# EAGLE schematic MegaFly_rev4.2 (EAGLE 7.5.0)
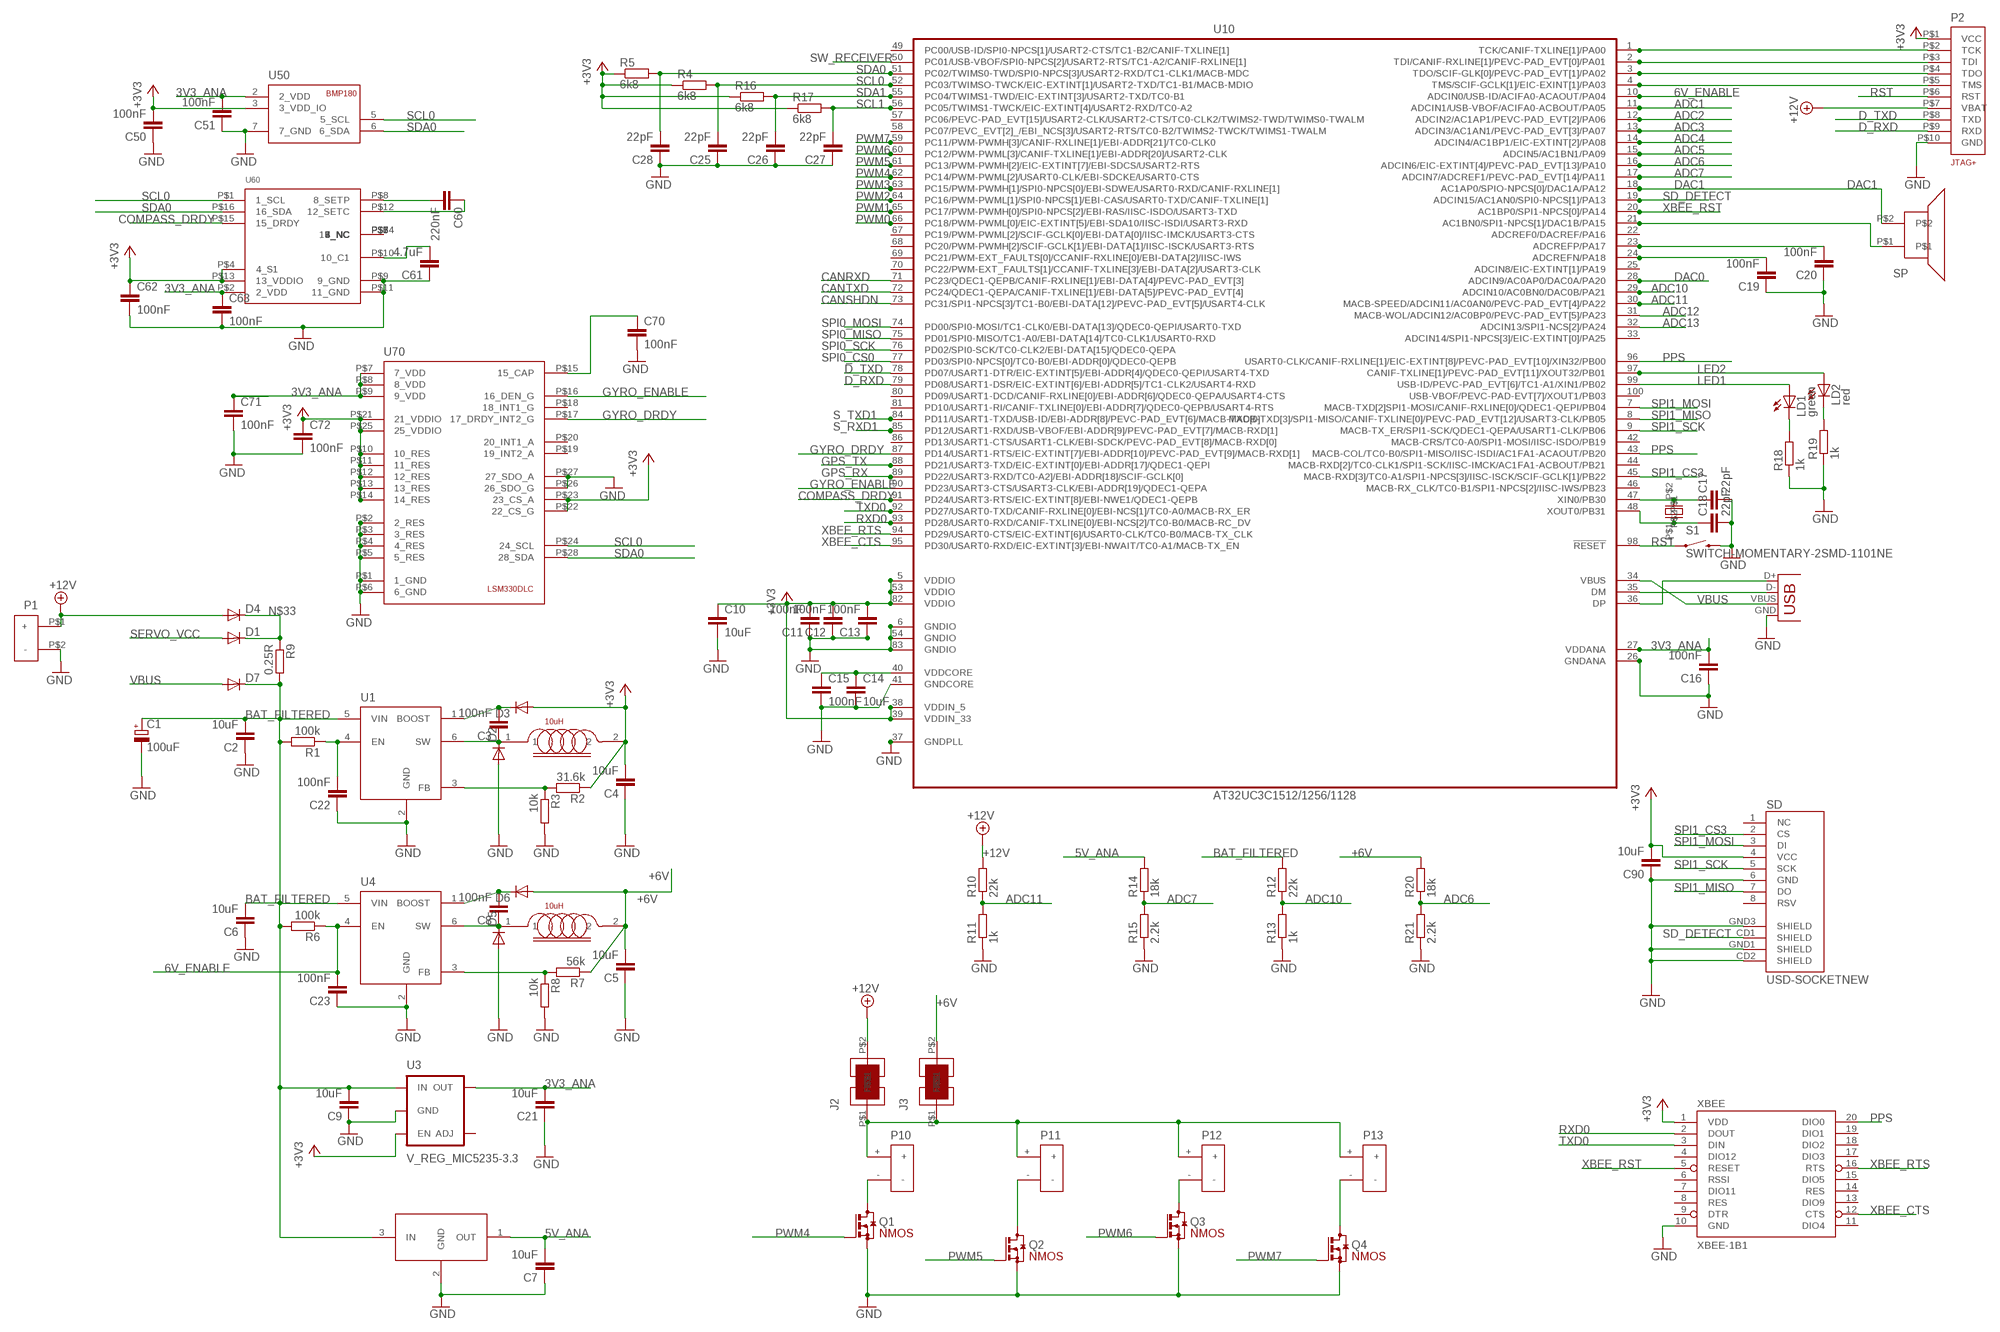
[diagram p0: schematic, sheet 1, part 1 of 2]
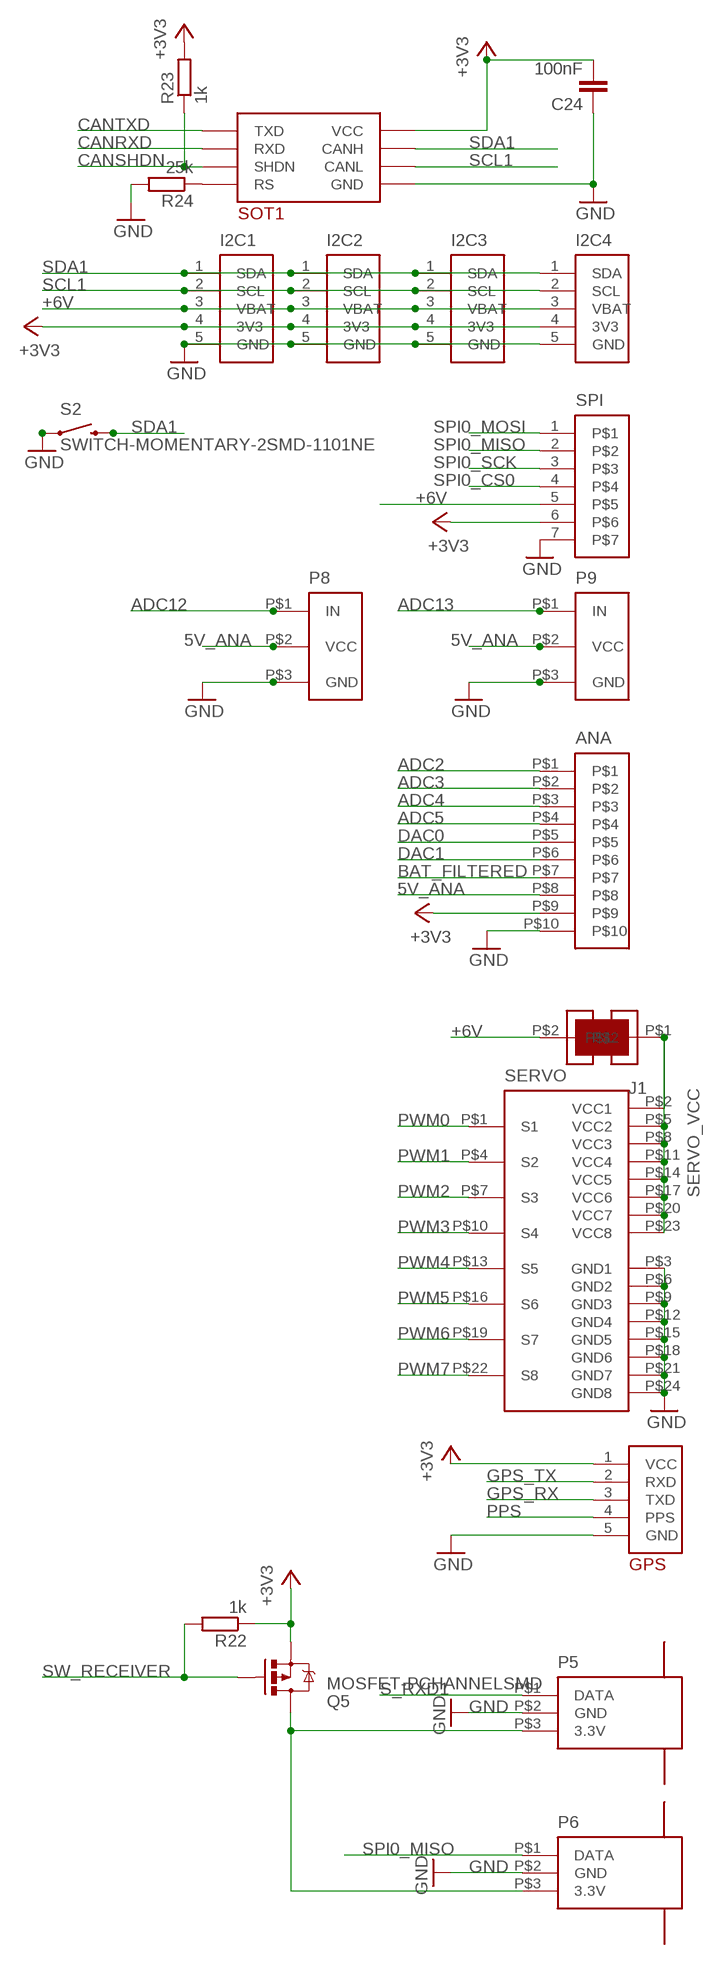
[diagram p1: schematic, sheet 1, part 2 of 2]

## Parts
ANA  MOLEX_CONNECTOR_10PINSMOLEX_PICOBLADE  [MOLEX_CONNECTOR_10PINS]
C1  100uF  CPOL-EUD/7343-31R  [D/7343-31R]
C2  10uF  C-EUC0805  [C0805]
C3  100nF  C-EUC0603  [C0603]
C4  10uF  C-EUC0805  [C0805]
C5  10uF  C-EUC0805  [C0805]
C6  10uF  C-EUC0805  [C0805]
C7  10uF  C-EUC0805  [C0805]
C8  100nF  C-EUC0603  [C0603]
C9  10uF  C-EUC0805  [C0805]
C10  10uF  C-EUC0805  [C0805]
C11  100nF  C-EUC0603  [C0603]
C12  100nF  C-EUC0603  [C0603]
C13  100nF  C-EUC0603  [C0603]
C14  10uF  C-EUC0805  [C0805]
C15  100nF  C-EUC0603  [C0603]
C16  100nF  C-EUC0603  [C0603]
C17  22pF  C-EUC0402  [C0402]
C18  22pF  C-EUC0402  [C0402]
C19  100nF  C-EUC0603  [C0603]
C20  100nF  C-EUC0603  [C0603]
C21  10uF  C-EUC0805  [C0805]
C22  100nF  C-EUC0603  [C0603]
C23  100nF  C-EUC0603  [C0603]
C24  100nF  C-EUC0603  [C0603]
C25  22pF  C-EUC0402  [C0402]
C26  22pF  C-EUC0402  [C0402]
C27  22pF  C-EUC0402  [C0402]
C28  22pF  C-EUC0402  [C0402]
C50  100nF  C-EUC0603  [C0603]
C51  100nF  C-EUC0603  [C0603]
C60  220nF  C-EUC0805  [C0805]
C61  4.7uF  C-EUC0805  [C0805]
C62  100nF  C-EUC0603  [C0603]
C63  100nF  C-EUC0603  [C0603]
C70  100nF  C-EUC0603  [C0603]
C71  100nF  C-EUC0603  [C0603]
C72  100nF  C-EUC0603  [C0603]
C90  10uF  C-EUC0805  [C0805]
D1  DIODESOD  [SOD-323]
D2  DIODESOD  [SOD-323]
D3  DIODESOD  [SOD-323]
D4  DIODESOD  [SOD-323]
D5  DIODESOD  [SOD-323]
D6  DIODESOD  [SOD-323]
D7  DIODESOD  [SOD-323]
GPS  APM2.5_GPS_HEADERVERTICAL  [MOLEX_CONNECTOR_5_PINS_VERTICAL]
I2C1  I2C_BUS_PICOVERTICAL  [MOLEX_CONNECTOR_5_PINS_VERTICAL]
I2C2  I2C_BUS_PICOVERTICAL  [MOLEX_CONNECTOR_5_PINS_VERTICAL]
I2C3  I2C_BUS_PICOVERTICAL  [MOLEX_CONNECTOR_5_PINS_VERTICAL]
I2C4  I2C_BUS_PICOVERTICAL  [MOLEX_CONNECTOR_5_PINS_VERTICAL]
J1  SOLDER_JUMPER_2WAY  [SOLDER_JUMPER_2WAY]
J2  SOLDER_JUMPER_2WAY  [SOLDER_JUMPER_2WAY]
J3  SOLDER_JUMPER_2WAY  [SOLDER_JUMPER_2WAY]
L1  10uH  INDUCTOR1210  [C1210]
L2  10uH  INDUCTOR1210  [C1210]
LD1  green  LEDCHIPLED_0805_GREEN  [CHIPLED_0805]
LD2  red  LEDCHIPLED_0805_RED  [CHIPLED_0805]
P1  POWER  [POWER]
P2  AVR32_JTAG+SERIALMOLEX_PICOBLADE  [MOLEX_CONNECTOR_10PINS]
P5  SPEKTRUM_RECEIVER  [JST_1.5MM_3WAY]
P6  SPEKTRUM_RECEIVER  [JST_1.5MM_3WAY]
P8  SENSOR  [SERVO_COMPACT]
P9  SENSOR  [SERVO_COMPACT]
P10  POWERSMALL_SMD  [POWER_SMALL_SMD]
P11  POWERSMALL_SMD  [POWER_SMALL_SMD]
P12  POWERSMALL_SMD  [POWER_SMALL_SMD]
P13  POWERSMALL_SMD  [POWER_SMALL_SMD]
Q1  N-CHANNEL_SOT23  [SOT23]
Q2  N-CHANNEL_SOT23  [SOT23]
Q3  N-CHANNEL_SOT23  [SOT23]
Q4  N-CHANNEL_SOT23  [SOT23]
Q5  MOSFET-PCHANNELSMD  [SOT23-3]
R1  100k  R-EU_R0603  [R0603]
R2  31.6k  R-EU_R0603  [R0603]
R3  10k  R-EU_R0603  [R0603]
R4  6k8  R-EU_R0603  [R0603]
R5  6k8  R-EU_R0603  [R0603]
R6  100k  R-EU_R0603  [R0603]
R7  56k  R-EU_R0603  [R0603]
R8  10k  R-EU_R0603  [R0603]
R9  0.25R  R-EU_R0805  [R0805]
R10  22k  R-EU_R0603  [R0603]
R11  1k  R-EU_R0603  [R0603]
R12  22k  R-EU_R0603  [R0603]
R13  1k  R-EU_R0603  [R0603]
R14  18k  R-EU_R0603  [R0603]
R15  2.2k  R-EU_R0603  [R0603]
R16  6k8  R-EU_R0603  [R0603]
R17  6k8  R-EU_R0603  [R0603]
R18  1k  R-EU_R0603  [R0603]
R19  1k  R-EU_R0603  [R0603]
R20  18k  R-EU_R0603  [R0603]
R21  2.2k  R-EU_R0603  [R0603]
R22  1k  R-EU_R0603  [R0603]
R23  1k  R-EU_R0603  [R0603]
R24  25k  R-EU_R0603  [R0603]
S1  SWITCH-MOMENTARY-2SMD-1101NE  [TACTILE-SWITCH-1101NE]
S2  SWITCH-MOMENTARY-2SMD-1101NE  [TACTILE-SWITCH-1101NE]
SD  USD-SOCKETNEW  [MICRO-SD-SOCKET-PP]
SERVO  SERVOCONNECTOR_X8STANDARD  [HEADER3X8]
SOT1  MAX3051  [SOT23-8L]
SP  PIEZO_SPEAKERSMALLER  [PIEZO_CMT_1203-SMT-REDUCED_FOOTPRINT]
SPI  MOLEX_CONNECTOR_7PINS  [MOLEX_CONNECTOR_7PINS]
U1  LM2734  [SOT23-6]
U2  MC78L05  LDO_3PINSOT89_MC78LXX  [SOT89]
U3  V_REG_MIC5235-3.3  V_REG_MIC5235  [SOT23-5]
U4  LM2734  [SOT23-6]
U10  AT32UC3C1512/1256/1128  [TQFP100]
U50  BMP180  [BMP180]
U60  HMC5883L  [LPCC16_0.5MM]
U70  LSM330DLC  [LSM330DLC]
USB  USB-MICROB  [USB-MICROB]
X1  CRYSTAL:ABM_16MHz  CRYSTAL  [SMD_CRYSTAL_ABM]
XBEE  XBEE-1B1  [XBEE-1]

## Nets
3V3_ANA: C16.2 C21.2 C51.2 C63.1 C71.1 U3.5(OUT) U10.27(VDDANA) U50.2(2_VDD) U60.P$2(2_VDD) U70.P$7(7_VDD) U70.P$8(8_VDD) U70.P$9(9_VDD)
5V_ANA [power]: ANA.P$8 C7.2 P8.P$2(VCC) P9.P$2(VCC) R14.2 U2.1(OUT)
6V_ENABLE: C23.2 R6.1 U4.4(EN) U10.10(ADCIN0/USB-ID/ACIFA0-ACAOUT/PA04)
+3V3 [power]: ANA.P$9 C4.2 C10.1 C11.2 C12.2 C13.2 C24.2 C50.2 C62.1 C72.1 C90.2 D3.2(A) GPS.1(VCC) I2C1.4(3V3) I2C2.4(3V3) I2C3.4(3V3) I2C4.4(3V3) L1.2 P2.P$1(VCC) Q5.2(S) R2.1 R4.1 R5.1 R16.1 R17.1 R22.1 R23.2 SD.4(VCC) SOT1.P$3(VCC) SPI.6 U3.3(EN) U10.5(VDDIO) U10.38(VDDIN_5) U10.39(VDDIN_33) U10.53(VDDIO) U10.82(VDDIO) U50.3(3_VDD_IO) U60.P$4(4_S1) U60.P$13(13_VDDIO) U70.P$10(10_RES) U70.P$11(11_RES) U70.P$12(12_RES) U70.P$13(13_RES) U70.P$14(14_RES) U70.P$21(21_VDDIO) U70.P$22(22_CS_G) U70.P$23(23_CS_A) U70.P$25(25_VDDIO) XBEE.1(VDD)
+6V [power]: C5.2 D6.2(A) I2C1.3(VBAT) I2C2.3(VBAT) I2C3.3(VBAT) I2C4.3(VBAT) J1.P$2 J3.P$2 L2.2 R7.1 R20.2 SPI.5
+12V [more_power]: D4.2(A) J2.P$2 P1.P$1(+) P2.P$7(VBAT) R10.2
ADC1: U10.11(ADCIN1/USB-VBOF/ACIFA0-ACBOUT/PA05)
ADC2: ANA.P$1 U10.12(ADCIN2/AC1AP1/PEVC-PAD_EVT[2]/PA06)
ADC3: ANA.P$2 U10.13(ADCIN3/AC1AN1/PEVC-PAD_EVT[3]/PA07)
ADC4: ANA.P$3 U10.14(ADCIN4/AC1BP1/EIC-EXTINT[2]/PA08)
ADC5: ANA.P$4 U10.15(ADCIN5/AC1BN1/PA09)
ADC6: R20.1 R21.2 U10.16(ADCIN6/EIC-EXTINT[4]/PEVC-PAD_EVT[13]/PA10)
ADC7: R14.1 R15.2 U10.17(ADCIN7/ADCREF1/PEVC-PAD_EVT[14]/PA11)
ADC10: R12.1 R13.2 U10.29(ADCIN10/AC0BN0/DAC0B/PA21)
ADC11: R10.1 R11.2 U10.30(MACB-SPEED/ADCIN11/AC0AN0/PEVC-PAD_EVT[4]/PA22)
ADC12: P8.P$1(IN) U10.31(MACB-WOL/ADCIN12/AC0BP0/PEVC-PAD_EVT[5]/PA23)
ADC13: P9.P$1(IN) U10.32(ADCIN13/SPI1-NCS[2]/PA24)
BAT_FILTERED [more_power]: ANA.P$7 C1.+ C2.2 C6.2 C9.2 D7.1(C) R1.2 R6.2 R9.2 R12.2 U1.5(VIN) U2.3(IN) U3.1(IN) U4.5(VIN)
CANRXD: SOT1.P$4(RXD) U10.71(PC23/QDEC1-QEPB/CANIF-RXLINE[1]/EBI-DATA[4]/PEVC-PAD_EVT[3])
CANSHDN: R23.1 SOT1.P$5(SHDN) U10.73(PC31/SPI1-NPCS[3]/TC1-B0/EBI-DATA[12]/PEVC-PAD_EVT[5]/USART4-CLK)
CANTXD: SOT1.P$1(TXD) U10.72(PC24/QDEC1-QEPA/CANIF-TXLINE[1]/EBI-DATA[5]/PEVC-PAD_EVT[4])
COMPASS_DRDY: U10.91(PD24/USART3-RTS/EIC-EXTINT[8]/EBI-NWE1/QDEC1-QEPB) U60.P$15(15_DRDY)
D_RXD: P2.P$9(RXD) U10.79(PD08/USART1-DSR/EIC-EXTINT[6]/EBI-ADDR[5]/TC1-CLK2/USART4-RXD)
D_TXD: P2.P$8(TXD) U10.78(PD07/USART1-DTR/EIC-EXTINT[5]/EBI-ADDR[4]/QDEC0-QEPI/USART4-TXD)
DAC0: ANA.P$5 U10.28(ADCIN9/AC0AP0/DAC0A/PA20)
DAC1: ANA.P$6 SP.P$2 U10.18(AC1AP0/SPIO-NPCS[0]/DAC1A/PA12)
GND [power]: ANA.P$10 C1.- C2.1 C4.1 C5.1 C6.1 C7.1 C9.1 C10.2 C11.1 C12.1 C13.1 C14.2 C15.2 C16.1 C17.2 C18.2 C19.1 C20.1 C21.1 C22.1 C23.1 C24.1 C25.1 C26.1 C27.1 C28.1 C50.1 C51.1 C61.1 C62.2 C63.2 C70.2 C71.2 C72.2 C90.1 D2.2(A) D5.2(A) GPS.5(GND) I2C1.5(GND) I2C2.5(GND) I2C3.5(GND) I2C4.5(GND) P1.P$2(-) P2.P$10(GND) P5.P$2(GND) P6.P$2(GND) P8.P$3(GND) P9.P$3(GND) Q1.2(S) Q2.2(S) Q3.2(S) Q4.2(S) R3.2 R8.2 R11.1 R13.1 R15.1 R18.1 R19.1 R21.1 R24.2 S1.P$2 S2.P$1 SD.6(GND) SD.CD2(SHIELD) SD.GND1(SHIELD) SD.GND3(SHIELD) SERVO.P$3(GND1) SERVO.P$6(GND2) SERVO.P$9(GND3) SERVO.P$12(GND4) SERVO.P$15(GND5) SERVO.P$18(GND6) SERVO.P$21(GND7) SERVO.P$24(GND8) SOT1.P$2(GND) SPI.7 U1.2(GND) U2.2(GND) U3.2(GND) U4.2(GND) U10.6(GNDIO) U10.26(GNDANA) U10.37(GNDPLL) U10.41(GNDCORE) U10.54(GNDIO) U10.83(GNDIO) U50.7(7_GND) U60.P$9(9_GND) U60.P$11(11_GND) U70.P$1(1_GND) U70.P$2(2_RES) U70.P$3(3_RES) U70.P$4(4_RES) U70.P$5(5_RES) U70.P$6(6_GND) U70.P$26(26_SDO_G) U70.P$27(27_SDO_A) USB.GND XBEE.10(GND)
GPS_RX: GPS.3(TXD) U10.89(PD22/USART3-RXD/TC0-A2]/EBI-ADDR[18]/SCIF-GCLK[0])
GPS_TX: GPS.2(RXD) U10.88(PD21/USART3-TXD/EIC-EXTINT[0]/EBI-ADDR[17]/QDEC1-QEPI)
GYRO_DRDY: U10.87(PD14/USART1-RTS/EIC-EXTINT[7]/EBI-ADDR[10]/PEVC-PAD_EVT[9]/MACB-RXD[1]) U70.P$17(17_DRDY_INT2_G)
GYRO_ENABLE: U10.90(PD23/USART3-CTS/USART3-CLK/EBI-ADDR[19]/QDEC1-QEPA) U70.P$16(16_DEN_G)
LED1: LD1.A U10.99(USB-ID/PEVC-PAD_EVT[6]/TC1-A1/XIN1/PB02)
LED2: LD2.A U10.97(CANIF-TXLINE[1]/PEVC-PAD_EVT[11]/XOUT32/PB01)
N$1: P2.P$5(TMS) U10.4(TMS/SCIF-GCLK[1]/EIC-EXINT[1]/PA03)
N$2: P2.P$4(TDO) U10.3(TDO/SCIF-GLK[0]/PEVC-PAD_EVT[1]/PA02)
N$3: C18.1 U10.48(XOUT0/PB31) X1.P$1
N$4: C17.1 U10.47(XIN0/PB30) X1.P$2
N$5: LD1.C R18.2
N$6: C22.2 R1.1 U1.4(EN)
N$7: LD2.C R19.2
N$8 [more_power]: C3.1 D2.1(C) L1.1 U1.6(SW)
N$9 [power]: R2.2 R3.1 U1.3(FB)
N$10: C3.2 D3.1(C) U1.1(BOOST)
N$11: SP.P$1 U10.21(AC1BN0/SPI1-NPCS[1]/DAC1B/PA15)
N$12: C61.2 U60.P$10(10_C1)
N$13: C60.2 U60.P$8(8_SETP)
N$14: C60.1 U60.P$12(12_SETC)
N$15: C70.1 U70.P$15(15_CAP)
N$16 [more_power]: J2.P$1 J3.P$1 P10.+ P11.+ P12.+ P13.+
N$17: P2.P$3(TDI) U10.2(TDI/CANIF-RXLINE[1]/PEVC-PAD_EVT[0]/PA01)
N$18 [more_power]: C8.1 D5.1(C) L2.1 U4.6(SW)
N$19: C14.1 C15.1 U10.40(VDDCORE)
N$20 [power]: R7.2 R8.1 U4.3(FB)
N$21: C8.2 D6.1(C) U4.1(BOOST)
N$22: P10.- Q1.3(D)
N$24: P11.- Q2.3(D)
N$25: P12.- Q3.3(D)
N$26: P13.- Q4.3(D)
N$28: U10.36(DP) USB.D+
N$29: P2.P$2(TCK) U10.1(TCK/CANIF-TXLINE[1]/PA00)
N$30: U10.35(DM) USB.D-
N$31: C19.2 U10.24(ADCREFN/PA18)
N$32: C20.2 U10.23(ADCREFP/PA17)
N$33 [more_power]: D1.1(C) D4.1(C) R9.1
N$34: P5.P$3(3.3V) P6.P$3(3.3V) Q5.3(D)
N$35: R24.1 SOT1.P$8(RS)
PPS: GPS.4(PPS) U10.43(MACB-COL/TC0-B0/SPI1-MISO/IISC-ISDI/AC1FA1-ACAOUT/PB20) U10.96(USART0-CLK/CANIF-RXLINE[1]/EIC-EXTINT[8]/PEVC-PAD_EVT[10]/XIN32/PB00) XBEE.20(DIO0)
PWM0: SERVO.P$1(S1) U10.66(PC18/PWM-PWML[0]/EIC-EXTINT[5]/EBI-SDA10/IISC-ISDI/USART3-RXD)
PWM1: SERVO.P$4(S2) U10.65(PC17/PWM-PWMH[0]/SPI0-NPCS[2]/EBI-RAS/IISC-ISDO/USART3-TXD)
PWM2: SERVO.P$7(S3) U10.64(PC16/PWM-PWML[1]/SPI0-NPCS[1]/EBI-CAS/USART0-TXD/CANIF-TXLINE[1])
PWM3: SERVO.P$10(S4) U10.63(PC15/PWM-PWMH[1]/SPI0-NPCS[0]/EBI-SDWE/USART0-RXD/CANIF-RXLINE[1])
PWM4: Q1.1(G) SERVO.P$13(S5) U10.62(PC14/PWM-PWML[2]/USART0-CLK/EBI-SDCKE/USART0-CTS)
PWM5: Q2.1(G) SERVO.P$16(S6) U10.61(PC13/PWM-PWMH[2]/EIC-EXTINT[7]/EBI-SDCS/USART2-RTS)
PWM6: Q3.1(G) SERVO.P$19(S7) U10.60(PC12/PWM-PWML[3]/CANIF-TXLINE[1]/EBI-ADDR[20]/USART2-CLK)
PWM7: Q4.1(G) SERVO.P$22(S8) U10.59(PC11/PWM-PWMH[3]/CANIF-RXLINE[1]/EBI-ADDR[21]/TC0-CLK0)
RST: P2.P$6(RST) S1.P$1 U10.98(!RESET)
RXD0: U10.93(PD28/USART0-RXD/CANIF-TXLINE[0]/EBI-NCS[2]/TC0-B0/MACB-RC_DV) XBEE.2(DOUT)
S_RXD1: P5.P$1(DATA) U10.85(PD12/USART1-RXD/USB-VBOF/EBI-ADDR[9]/PEVC-PAD_EVT[7]/MACB-RXD[1])
S_TXD1: U10.84(PD11/USART1-TXD/USB-ID/EBI-ADDR[8]/PEVC-PAD_EVT[6]/MACB-TXD[0])
SCL0: C25.2 R4.2 U10.52(PC03/TWIMSO-TWCK/EIC-EXTINT[1]/USART2-TXD/TC1-B1/MACB-MDIO) U50.5(5_SCL) U60.P$1(1_SCL) U70.P$24(24_SCL)
SCL1: C27.2 I2C1.2(SCL) I2C2.2(SCL) I2C3.2(SCL) I2C4.2(SCL) R17.2 SOT1.P$6(CANL) U10.56(PC05/TWIMS1-TWCK/EIC-EXTINT[4]/USART2-RXD/TC0-A2)
SD_DETECT: SD.CD1(SHIELD) U10.19(ADCIN15/AC1AN0/SPI0-NPCS[1]/PA13)
SDA0: C28.2 R5.2 U10.51(PC02/TWIMS0-TWD/SPI0-NPCS[3]/USART2-RXD/TC1-CLK1/MACB-MDC) U50.6(6_SDA) U60.P$16(16_SDA) U70.P$28(28_SDA)
SDA1: C26.2 I2C1.1(SDA) I2C2.1(SDA) I2C3.1(SDA) I2C4.1(SDA) R16.2 S2.P$2 SOT1.P$7(CANH) U10.55(PC04/TWIMS1-TWD/EIC-EXTINT[3]/USART2-TXD/TC0-B1)
SERVO_VCC [more_power]: D1.2(A) J1.P$1 SERVO.P$2(VCC1) SERVO.P$5(VCC2) SERVO.P$8(VCC3) SERVO.P$11(VCC4) SERVO.P$14(VCC5) SERVO.P$17(VCC6) SERVO.P$20(VCC7) SERVO.P$23(VCC8)
SPI0_CS0: SPI.4 U10.77(PD03/SPI0-NPCS[0]/TC0-B0/EBI-ADDR[0]/QDEC0-QEPB)
SPI0_MISO: P6.P$1(DATA) SPI.2 U10.75(PD01/SPI0-MISO/TC1-A0/EBI-DATA[14]/TC0-CLK1/USART0-RXD)
SPI0_MOSI: SPI.1 U10.74(PD00/SPI0-MOSI/TC1-CLK0/EBI-DATA[13]/QDEC0-QEPI/USART0-TXD)
SPI0_SCK: SPI.3 U10.76(PD02/SPI0-SCK/TC0-CLK2/EBI-DATA[15]/QDEC0-QEPA)
SPI1_CS3: SD.2(CS) U10.45(MACB-RXD[3]/TC0-A1/SPI1-NPCS[3]/IISC-ISCK/SCIF-GCLK[1]/PB22)
SPI1_MISO: SD.7(DO) U10.8(MACB-TXD[3]/SPI1-MISO/CANIF-TXLINE[0]/PEVC-PAD_EVT[12]/USART3-CLK/PB05)
SPI1_MOSI: SD.3(DI) U10.7(MACB-TXD[2]SPI1-MOSI/CANIF-RXLINE[0]/QDEC1-QEPI/PB04)
SPI1_SCK: SD.5(SCK) U10.9(MACB-TX_ER/SPI1-SCK/QDEC1-QEPA/USART1-CLK/PB06)
SW_RECEIVER: Q5.1(G) R22.2 U10.50(PC01/USB-VBOF/SPI0-NPCS[2]/USART2-RTS/TC1-A2/CANIF-RXLINE[1])
TXD0: U10.92(PD27/USART0-TXD/CANIF-RXLINE[0]/EBI-NCS[1]/TC0-A0/MACB-RX_ER) XBEE.3(DIN)
VBUS: D7.2(A) U10.34(VBUS) USB.VBUS
XBEE_CTS: U10.95(PD30/USART0-RXD/EIC-EXTINT[3]/EBI-NWAIT/TC0-A1/MACB-TX_EN) XBEE.12(CTS)
XBEE_RST: U10.20(AC1BP0/SPI1-NPCS[0]/PA14) XBEE.5(RESET)
XBEE_RTS: U10.94(PD29/USART0-CTS/EIC-EXTINT[6]/USART0-CLK/TC0-B0/MACB-TX_CLK) XBEE.16(RTS)
Unconnected: SD.1(NC) SD.8(RSV) U3.4(ADJ) U10.22(ADCREF0/DACREF/PA16) U10.25(ADCIN8/EIC-EXTINT[1]/PA19) U10.33(ADCIN14/SPI1-NPCS[3]/EIC-EXTINT[0]/PA25) U10.42(MACB-CRS/TC0-A0/SPI1-MOSI/IISC-ISDO/PB19) U10.44(MACB-RXD[2]/TC0-CLK1/SPI1-SCK/IISC-IMCK/AC1FA1-ACBOUT/PB21) U10.46(MACB-RX_CLK/TC0-B1/SPI1-NPCS[2]/IISC-IWS/PB23) U10.49(PC00/USB-ID/SPI0-NPCS[1]/USART2-CTS/TC1-B2/CANIF-TXLINE[1]) U10.57(PC06/PEVC-PAD_EVT[15]/USART2-CLK/USART2-CTS/TC0-CLK2/TWIMS2-TWD/TWIMS0-TWALM) U10.58(PC07/PEVC_EVT[2]_/EBI_NCS[3]/USART2-RTS/TC0-B2/TWIMS2-TWCK/TWIMS1-TWALM) U10.67(PC19/PWM-PWML[2]/SCIF-GCLK[0]/EBI-DATA[0]/IISC-IMCK/USART3-CTS) U10.68(PC20/PWM-PWMH[2]/SCIF-GCLK[1]/EBI-DATA[1]/IISC-ISCK/USART3-RTS) U10.69(PC21/PWM-EXT_FAULTS[0]/CCANIF-RXLINE[0]/EBI-DATA[2]/IISC-IWS) U10.70(PC22/PWM-EXT_FAULTS[1]/CCANIF-TXLINE[3]/EBI-DATA[2]/USART3-CLK) U10.80(PD09/USART1-DCD/CANIF-RXLINE[0]/EBI-ADDR[6]/QDEC0-QEPA/USART4-CTS) U10.81(PD10/USART1-RI/CANIF-TXLINE[0]/EBI-ADDR[7]/QDEC0-QEPB/USART4-RTS) U10.86(PD13/USART1-CTS/USART1-CLK/EBI-SDCK/PEVC-PAD_EVT[8]/MACB-RXD[0]) U10.100(USB-VBOF/PEVC-PAD-EVT[7]/XOUT1/PB03) U60.P$3(3_NC) U60.P$5(5_NC) U60.P$6(6_NC) U60.P$7(7_NC) U60.P$14(14_NC) U70.P$18(18_INT1_G) U70.P$19(19_INT2_A) U70.P$20(20_INT1_A) XBEE.4(DIO12) XBEE.6(RSSI) XBEE.7(DIO11) XBEE.8(RES) XBEE.9(DTR) XBEE.11(DIO4) XBEE.13(DIO9) XBEE.14(RES) XBEE.15(DIO5) XBEE.17(DIO3) XBEE.18(DIO2) XBEE.19(DIO1)

## Library data of the parts
ANA = con-special_purpose:MOLEX_CONNECTOR_10PINS: Molex Connector : PicoBlade 1.25 mm pitch, 10 pins, Vertical SMD; DISTRIBUTOR: Digikey; ORDER_CODE: WM7628CT-ND; PLACE_PART: YES; UNIT_PRICE: 1.74; UNIT_PRICE_100X: 1.3578; UNIT_PRICE_10X: 1.584; UNIT_PRICE_25X: 1.4868; UNIT_PRICE_50X: 1.4224
C1 = rcl:CPOL-EU: POLARIZED CAPACITOR, European symbol; DISTRIBUTOR: Digikey; ORDER_CODE: 718-1744-1-ND; PLACE_PART: YES; UNIT_PRICE: 1.23; UNIT_PRICE_100X: 0.8079; UNIT_PRICE_10X: 1.004; UNIT_PRICE_25X: 1.004; UNIT_PRICE_50X: 1.004
C2-C28 C50 C51 C60-C63 C70-C72 C90 = rcl:C-EU: CAPACITOR, European symbol; PLACE_PART: YES
D1-D7 = power:DIODE: Diode These are standard reverse protection diodes and small signal diodes. SMA package can handle up to about 1A. SOD-323 can handle about 200mA. What the SOD-323 package when ordering, there are some mfgs out there that are 5-pin packages.; DISTRIBUTOR: Digikey; ORDER_CODE: 568-4128-1-ND; PLACE_PART: YES; UNIT_PRICE: 0.36; UNIT_PRICE_100X: 0.1907; UNIT_PRICE_10X: 0.277; UNIT_PRICE_25X: 0.234; UNIT_PRICE_50X: 0.234
GPS = con-special_purpose:APM2.5_GPS_HEADER; DISTRIBUTOR: Digikey; ORDER_CODE: WM7609CT-ND; PLACE_PART: YES; UNIT_PRICE: 1.28; UNIT_PRICE_100X: 0.9771; UNIT_PRICE_10X: 1.132; UNIT_PRICE_25X: 1.0656; UNIT_PRICE_50X: 1.0214
I2C1-I2C4 = con-special_purpose:I2C_BUS_PICO; DISTRIBUTOR: Digikey; ORDER_CODE: WM7609CT-ND; PLACE_PART: YES; UNIT_PRICE: 1.28; UNIT_PRICE_100X: 0.9771; UNIT_PRICE_10X: 1.132; UNIT_PRICE_25X: 1.0656; UNIT_PRICE_50X: 1.0214
J1-J3 = con-special_purpose:SOLDER_JUMPER_2WAY; PLACE_PART: NO
L1 L2 = power:INDUCTOR; DISTRIBUTOR: Digikey; ORDER_CODE: 445-4847-1-ND; PLACE_PART: YES; UNIT_PRICE: 0.36; UNIT_PRICE_100X: 0.2423; UNIT_PRICE_10X: 0.323; UNIT_PRICE_25X: 0.323; UNIT_PRICE_50X: 0.2624
LD1 = LEDs:LED: LED OSRAM: - CHIPLED LG R971, LG N971, LY N971, LG Q971, LY Q971, LO R971, LY R971 LH N974, LH R974 LS Q976, LO Q976, LY Q976 LO Q996 - Hyper CHIPLED LW Q18S LB Q993, LB Q99A, LB R99A - SideLED LS A670, LO A670, LY A670, LG A670, LP A670 LB A673, LV A673, LT A673, LW A673 LH A674 LY A675 LS A676, LA A676, LO A676, LY A676, LW A676 LS A679, LY A679, LG A679 - Hyper Micro SIDELED® LS Y876, LA Y876, LO Y876, LY Y876 LT Y87S - SmartLED LW L88C, LW L88S LB L89C, LB L89S, LG L890 LS L89K, LO L89K, LY L89K LS L896, LA L896, LO L896, LY L896 - TOPLED LS T670, LO T670, LY T670, LG T670, LP T670 LSG T670, LSP T670, LSY T670, LOP T670, LYG T670 LG T671, LOG T671, LSG T671 LB T673, LV T673, LT T673, LW T673 LH T674 LS T676, LA T676, LO T676, LY T676, LB T676, LH T676, LSB T676, LW T676 LB T67C, LV T67C, LT T67C, LS T67K, LO T67K, LY T67K, LW E67C LS E67B, LA E67B, LO E67B, LY E67B, LB E67C, LV E67C, LT E67C LW T67C LS T679, LY T679, LG T679 LS T770, LO T770, LY T770, LG T770, LP T770 LB T773, LV T773, LT T773, LW T773 LH T774 LS E675, LA E675, LY E675, LS T675 LS T776, LA T776, LO T776, LY T776, LB T776 LHGB T686 LT T68C, LB T68C - Hyper Mini TOPLED® LB M676 - Mini TOPLED Santana® LG M470 LS M47K, LO M47K, LY M47K Source: http://www.osram.convergy.de LUXEON: - LUMILED® LXK2-PW12-R00, LXK2-PW12-S00, LXK2-PW14-U00, LXK2-PW14-V00 LXK2-PM12-R00, LXK2-PM12-S00, LXK2-PM14-U00 LXK2-PE12-Q00, LXK2-PE12-R00, LXK2-PE12-S00, LXK2-PE14-T00, LXK2-PE14-U00 LXK2-PB12-K00, LXK2-PB12-L00, LXK2-PB12-M00, LXK2-PB14-N00, LXK2-PB14-P00, LXK2-PB14-Q00 LXK2-PR12-L00, LXK2-PR12-M00, LXK2-PR14-Q00, LXK2-PR14-R00 LXK2-PD12-Q00, LXK2-PD12-R00, LXK2-PD12-S00 LXK2-PH12-R00, LXK2-PH12-S00 LXK2-PL12-P00, LXK2-PL12-Q00, LXK2-PL12-R00 Source: www.luxeon.com KINGBRIGHT: KA-3528ASYC Source: www.kingbright.com; DISTRIBUTOR: Digikey; ORDER_CODE: 754-1131-1-ND; PLACE_PART: YES; UNIT_PRICE: 0.25; UNIT_PRICE_100X: 0.1365; UNIT_PRICE_10X: 0.189; UNIT_PRICE_25X: 0.1512; UNIT_PRICE_50X: 0.1512
LD2 = LEDs:LED: LED OSRAM: - CHIPLED LG R971, LG N971, LY N971, LG Q971, LY Q971, LO R971, LY R971 LH N974, LH R974 LS Q976, LO Q976, LY Q976 LO Q996 - Hyper CHIPLED LW Q18S LB Q993, LB Q99A, LB R99A - SideLED LS A670, LO A670, LY A670, LG A670, LP A670 LB A673, LV A673, LT A673, LW A673 LH A674 LY A675 LS A676, LA A676, LO A676, LY A676, LW A676 LS A679, LY A679, LG A679 - Hyper Micro SIDELED® LS Y876, LA Y876, LO Y876, LY Y876 LT Y87S - SmartLED LW L88C, LW L88S LB L89C, LB L89S, LG L890 LS L89K, LO L89K, LY L89K LS L896, LA L896, LO L896, LY L896 - TOPLED LS T670, LO T670, LY T670, LG T670, LP T670 LSG T670, LSP T670, LSY T670, LOP T670, LYG T670 LG T671, LOG T671, LSG T671 LB T673, LV T673, LT T673, LW T673 LH T674 LS T676, LA T676, LO T676, LY T676, LB T676, LH T676, LSB T676, LW T676 LB T67C, LV T67C, LT T67C, LS T67K, LO T67K, LY T67K, LW E67C LS E67B, LA E67B, LO E67B, LY E67B, LB E67C, LV E67C, LT E67C LW T67C LS T679, LY T679, LG T679 LS T770, LO T770, LY T770, LG T770, LP T770 LB T773, LV T773, LT T773, LW T773 LH T774 LS E675, LA E675, LY E675, LS T675 LS T776, LA T776, LO T776, LY T776, LB T776 LHGB T686 LT T68C, LB T68C - Hyper Mini TOPLED® LB M676 - Mini TOPLED Santana® LG M470 LS M47K, LO M47K, LY M47K Source: http://www.osram.convergy.de LUXEON: - LUMILED® LXK2-PW12-R00, LXK2-PW12-S00, LXK2-PW14-U00, LXK2-PW14-V00 LXK2-PM12-R00, LXK2-PM12-S00, LXK2-PM14-U00 LXK2-PE12-Q00, LXK2-PE12-R00, LXK2-PE12-S00, LXK2-PE14-T00, LXK2-PE14-U00 LXK2-PB12-K00, LXK2-PB12-L00, LXK2-PB12-M00, LXK2-PB14-N00, LXK2-PB14-P00, LXK2-PB14-Q00 LXK2-PR12-L00, LXK2-PR12-M00, LXK2-PR14-Q00, LXK2-PR14-R00 LXK2-PD12-Q00, LXK2-PD12-R00, LXK2-PD12-S00 LXK2-PH12-R00, LXK2-PH12-S00 LXK2-PL12-P00, LXK2-PL12-Q00, LXK2-PL12-R00 Source: www.luxeon.com KINGBRIGHT: KA-3528ASYC Source: www.kingbright.com; DISTRIBUTOR: Digikey; ORDER_CODE: 754-1132-1-ND; PLACE_PART: YES; UNIT_PRICE: 0.15; UNIT_PRICE_100X: 0.0814; UNIT_PRICE_10X: 0.113; UNIT_PRICE_25X: 0.09; UNIT_PRICE_50X: 0.09
P1 = con-special_purpose:POWER; DISTRIBUTOR: Mouser; ORDER_CODE: 653-XG8S-0231; PLACE_PART: YES; UNIT_PRICE: 0.096; UNIT_PRICE_100X: 0.072; UNIT_PRICE_10X: 0.096; UNIT_PRICE_25X: 0.088; UNIT_PRICE_50X: 0.08
P2 = con-special_purpose:AVR32_JTAG+SERIAL: Unified compact debug port with JTAG, 7-12V power supply (VBAT) and serial port.; DISTRIBUTOR: Digikey; ORDER_CODE: WM7628CT-ND; PLACE_PART: YES; UNIT_PRICE: 1.74; UNIT_PRICE_100X: 1.3578; UNIT_PRICE_10X: 1.584; UNIT_PRICE_25X: 1.4868; UNIT_PRICE_50X: 1.4224
P5 P6 = con-special_purpose:SPEKTRUM_RECEIVER; DISTRIBUTOR: Digikey; ORDER_CODE: 455-1658-ND; PLACE_PART: YES; UNIT_PRICE: 0.14; UNIT_PRICE_100X: 0.0895; UNIT_PRICE_10X: 0.129; UNIT_PRICE_25X: 0.129; UNIT_PRICE_50X: 0.0962
P8 P9 = con-special_purpose:SENSOR; PLACE_PART: NO
P10-P13 = con-special_purpose:POWER; PLACE_PART: NO
Q1-Q4 = transistors:N-CHANNEL_SOT23: N-CHANNEL MOS FET; DISTRIBUTOR: Digikey; ORDER_CODE: IRLML6244TRPBFCT-ND; PLACE_PART: YES; UNIT_PRICE: 0.41; UNIT_PRICE_100X: 0.1505; UNIT_PRICE_10X: 0.232; UNIT_PRICE_25X: 0.2; UNIT_PRICE_50X: 0.1684
Q5 = transistors:MOSFET-PCHANNEL; DISTRIBUTOR: Digikey; ORDER_CODE: SSM3J328RLF(TCT-ND; PLACE_PART: YES; UNIT_PRICE: 0.38; UNIT_PRICE_100X: 0.1756; UNIT_PRICE_10X: 0.267; UNIT_PRICE_25X: 0.2196; UNIT_PRICE_50X: 0.2196
R1 R3-R8 R10-R23 = rcl:R-EU_: RESISTOR, European symbol; PLACE_PART: YES
R2 = rcl:R-EU_: RESISTOR, European symbol; DISTRIBUTOR: Digikey; ORDER_CODE: RMCF0603FT31K6CT-ND; PLACE_PART: YES
R9 = rcl:R-EU_: RESISTOR, European symbol; DISTRIBUTOR: Digikey; ORDER_CODE: 311-.25SCT-ND; PLACE_PART: YES
R24 = rcl:R-EU_: RESISTOR, European symbol; DISTRIBUTOR: Digikey; ORDER_CODE: PNM0603-25KBCT-ND; PLACE_PART: YES
S1 S2 = con-special_purpose:SWITCH-MOMENTARY-2; DISTRIBUTOR: Digikey; ORDER_CODE: 450-1140-ND; PLACE_PART: YES; UNIT_PRICE: 0.19; UNIT_PRICE_100X: 0.1606; UNIT_PRICE_10X: 0.183; UNIT_PRICE_25X: 0.1764; UNIT_PRICE_50X: 0.17
SD = con-special_purpose:USD-SOCKET: microSD Socket Push-push type uSD socket. Schematic element and footprint production proven. Spark Fun Electronics SKU : PRT-00127. tDoc lines correctly indicate media card edge positions when inserting (unlocked, locked, depressed).; DISTRIBUTOR: Mouser; ORDER_CODE: 517-2908-05WB-MG; PLACE_PART: YES; UNIT_PRICE: 1.94; UNIT_PRICE_100X: 1.42; UNIT_PRICE_10X: 1.94; UNIT_PRICE_25X: 1.74; UNIT_PRICE_50X: 1.6
SERVO = con-special_purpose:SERVOCONNECTOR_X8; PLACE_PART: NO
SOT1 = SpecialIC:MAX3051; DISTRIBUTOR: Mouser; ORDER_CODE: 700-MAX3051EKAT; PLACE_PART: YES; UNIT_PRICE: 2.64; UNIT_PRICE_100X: 1.73; UNIT_PRICE_10X: 2.64; UNIT_PRICE_25X: 1.98; UNIT_PRICE_50X: 1.88
SP = SpecialIC:PIEZO_SPEAKER; DISTRIBUTOR: Digikey; ORDER_CODE: 102-2197-1-ND; PLACE_PART: YES; UNIT_PRICE: 1.99; UNIT_PRICE_100X: 1.2329; UNIT_PRICE_10X: 1.644; UNIT_PRICE_25X: 1.644; UNIT_PRICE_50X: 1.644
SPI = con-special_purpose:MOLEX_CONNECTOR_7PINS: Molex Picoblade connector, 7 pins SMD; DISTRIBUTOR: Digikey; ORDER_CODE: WM7625CT-ND; PLACE_PART: YES; UNIT_PRICE: 1.28; UNIT_PRICE_100X: 0.9673; UNIT_PRICE_10X: 1.121; UNIT_PRICE_25X: 1.0552; UNIT_PRICE_50X: 1.0112
U1 U4 = power:LM2734; DISTRIBUTOR: Digikey; ORDER_CODE: LM2734ZMK/NOPBCT-ND; PLACE_PART: YES; UNIT_PRICE: 2.83; UNIT_PRICE_100X: 2.0705; UNIT_PRICE_10X: 2.532; UNIT_PRICE_25X: 2.2764; UNIT_PRICE_50X: 2.2764
U2 = power:LDO_3PIN; DISTRIBUTOR: Digikey; ORDER_CODE: MC78L05ACHXCT-ND; PLACE_PART: YES; UNIT_PRICE: 0.41; UNIT_PRICE_100X: 0.2236; UNIT_PRICE_10X: 0.325; UNIT_PRICE_25X: 0.2744; UNIT_PRICE_50X: 0.2744
U3 = power:V_REG_MIC5235; DISTRIBUTOR: Digikey; ORDER_CODE: 576-2784-1-ND; PLACE_PART: YES; UNIT_PRICE: 0.9; UNIT_PRICE_100X: 0.6387; UNIT_PRICE_10X: 0.804; UNIT_PRICE_25X: 0.7096; UNIT_PRICE_50X: 0.7096
U10 = atmel-avr32-michel:AT32UC3C1512/1256/1128: AT32UC3C1512/1256/1128; DISTRIBUTOR: Digikey; ORDER_CODE: AT32UC3C1512C-AUT-ND; PLACE_PART: YES; UNIT_PRICE: 12.95; UNIT_PRICE_100X: 10.0128; UNIT_PRICE_10X: 11.78; UNIT_PRICE_25X: 10.8964; UNIT_PRICE_50X: 10.8964
U50 = Sensors:BMP180; DISTRIBUTOR: Rutronik; ORDER_CODE: ICIN2533; PLACE_PART: YES; UNIT_PRICE: 3.28
U60 = Sensors:HMC5883L; DISTRIBUTOR: Digikey; ORDER_CODE: 342-1082-1-ND; PLACE_PART: YES; UNIT_PRICE: 2.67; UNIT_PRICE_100X: 1.4507; UNIT_PRICE_10X: 1.824; UNIT_PRICE_25X: 1.6408; UNIT_PRICE_50X: 1.536
U70 = Sensors:LSM330DLC; DISTRIBUTOR: Mouser; ORDER_CODE: 511-LSM330DLC; PLACE_PART: YES; UNIT_PRICE: 5.25; UNIT_PRICE_100X: 3.88; UNIT_PRICE_10X: 4.73; UNIT_PRICE_25X: 4.30; UNIT_PRICE_50X: 4.30
USB = con-special_purpose:USB: USB Connectors USB-B-PTH is fully proven SKU : PRT-00139 USB-miniB is fully proven SKU : PRT-00587 USB-A-PCB is untested. USB-A-H is throughly reviewed, but untested. Spark Fun Electronics SKU : PRT-00437 USB-B-SMT is throughly reviewed, but untested. Needs silkscreen touching up. USB-A-S has not been used/tested USB-MB-H has not been used/tested; DISTRIBUTOR: Digikey; ORDER_CODE: 609-4613-1-ND; PLACE_PART: YES; UNIT_PRICE: 0.37; UNIT_PRICE_100X: 0.2449; UNIT_PRICE_10X: 0.35; UNIT_PRICE_25X: 0.2996; UNIT_PRICE_50X: 0.2548
X1 = Atmel_utils:CRYSTAL; DISTRIBUTOR: Digikey; ORDER_CODE: 535-9840-1-ND; PLACE_PART: YES; UNIT_PRICE: 0.78; UNIT_PRICE_100X: 0.5653; UNIT_PRICE_10X: 0.684; UNIT_PRICE_25X: 0.684; UNIT_PRICE_50X: 0.6388
XBEE = con-special_purpose:XBEE-1; DISTRIBUTOR: Mouser; ORDER_CODE: 855-M22-7131042; PLACE_PART: YES; UNIT_PRICE: 1.23; UNIT_PRICE_100X: 0.957; UNIT_PRICE_10X: 1.01; UNIT_PRICE_25X: 1.01; UNIT_PRICE_50X: 1.01

## Net classes
0 default: width 0.15 mm, drill 0.3 mm, clearance 0.15 mm
1 power: width 0.2 mm, drill 0.3 mm, clearance 0.15 mm
2 more_power: width 0.4 mm, drill 0.5 mm, clearance 0.15 mm